# Altium schematic sheet xxxxxx.001_sh3_RTC.SchDoc
size 419 x 297 mm; DocumentNumber: 3; SheetNumber: 3; DocumentNumberE3: XXXX.467119.XXX Э3
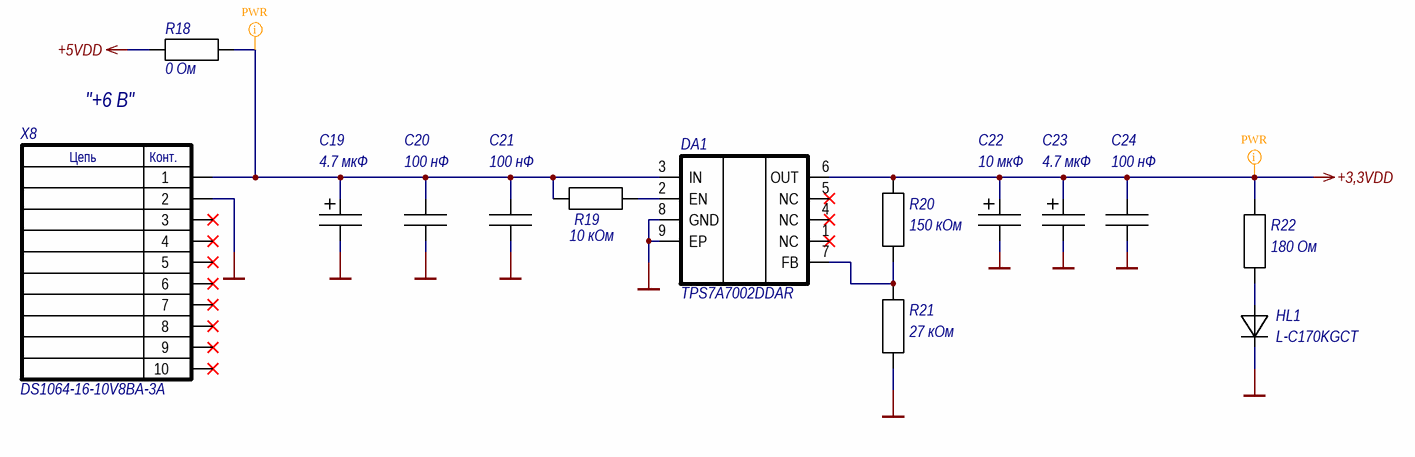
[diagram p0: xxxxxx.001_sh3_RTC.SchDoc]

## Parts
C19  4.7 мкФ  [CAPMP3216X180N]
C20  100 нФ  [CAPC160X080X080N]
C21  100 нФ  [CAPC160X080X080N]
C22  10 мкФ  [CAPMP3216X180N]
C23  4.7 мкФ  [CAPMP3216X180N]
C24  100 нФ  [CAPC160X080X080N]
DA1  TPS7A7002DDAR  [SOIC127P600X170_HS-9N]
HL1  L-C170KGCT  [LEDC200X125X075N_RED]
R18  0 Ом  [RESC160X080X045N]
R19  10 кОм  [RESC160X080X045N]
R20  150 кОм  [RESC160X080X045N]
R21  27 кОм  [RESC160X080X045N]
R22  180 Ом  [RESC160X080X045N]
X8  DS1064-16-10V8BA-3A  [BHTH127x254_2X5]

## Nets
+3,3VDD: C22.1 C23.1 C24.1 DA1.6(OUT) R20.1 R22.1
+5VDD: R18.1
GND: C19.2 C20.2 C21.2 C22.2 C23.2 C24.2 DA1.8(GND) DA1.9(EP) HL1.2 R21.2 X8.2
NetC19_1: C19.1 C20.1 C21.1 DA1.3(IN) R18.2 R19.1 X8.1
NetDA1_2: DA1.2(EN) R19.2
NetDA1_7: DA1.7(FB) R20.2 R21.1
NetHL1_1: HL1.1 R22.2

Not connected (* = marked no-connect by the designer): DA1 1(NC)* 4(NC)* 5(NC)*; X8 3* 4* 5* 6* 7* 8* 9* 10*

## Layout directives
net class PWR: +3,3VDD, NetC19_1

## Notes on the sheet
- (near R18) "+6 В"
- Подп. и дата
- Инв. № дубл.
- Взам. инв. №
- Лист
- Инв. № подл.
- Изм.
- № докум.
- Подп.
- Дата
- Копировал
- Формат A3
- (in symbol 16896) Цепь; Конт.

## Library data of the parts
C19 C23 = 16907: Solid Tantalum Surface Mount Capacitor; Manufacturer: AVX; Part Number: TAJA475M025RNJ; Number: 16907; Type: Конденсатор; Voltage: 25 В; Tolerance: ±20%; ValueBOM: Solid Tantalum Surface Mount Capacitor, CAP TNT A, 4.7u x 25V; Package: CAP TNT A; Series: TAJ; Ceramic Type: 4.7 мкФ; ValueSCH: 4.7 мкФ; HelpURL: http://www.avx.com/; ComponentLink1Description: Datasheet; ComponentLink1URL: ftp://51.15.50.217/avx/capacitors/TAJ.PDF; Modify Date: 20.02.2009; Note: *; ManufacturerPartNumber: TAJA475M025RNJ
C20 C21 C24 = 16734: Chip Monolithic Ceramic Capacitor; Manufacturer: Murata; Part Number: GRM188R71E104KA01D; Number: 16734; Type: Конденсатор; Ceramic Type: X7R; Voltage: 25 В; Tolerance: ±10%; ValueBOM: Chip Monolithic Ceramic Capacitor, 0603, X7R, 25V, ±10%, 100n; Package: 0603; Series: GRM188; ValueSCH: 100 нФ; ComponentLink1Description: Datasheet; ComponentLink1URL: ftp://51.15.50.217/murata/capacitors/chip_monolithic_ceramic_cap.pdf; Note: *; ManufacturerPartNumber: GRM188R71E104KA01D
C22 = 16905: Solid Tantalum Surface Mount Capacitor; Manufacturer: AVX; Part Number: TAJA106M016RNJ; Number: 16905; Type: Конденсатор; Voltage: 16 В; Tolerance: ±20%; ValueBOM: Solid Tantalum Surface Mount Capacitor, CAP TNT A, 10u x 16V; Package: CAP TNT A; Series: TAJ; Ceramic Type: 10 мкФ; ValueSCH: 10 мкФ; HelpURL: http://www.avx.com/; ComponentLink1Description: Datasheet; ComponentLink1URL: ftp://51.15.50.217/avx/capacitors/TAJ.PDF; Modify Date: 19.02.2009; Note: *; ManufacturerPartNumber: TAJA106M016RNJ
DA1 = 16901: Very Low Input, Very Low Dropout 3-A Regulator With Enable; Manufacturer: Texas Instruments; Number: 16901; Type: Микросхема аналоговая; Part Number: TPS7A7002DDAR; ValueSCH: TPS7A7002DDAR; ValueBOM: Very Low Input, Very Low Dropout 3-A Regulator With Enable; Modify Date: 21.06.2023; Note: *; ManufacturerPartNumber: TPS7A7002DDAR
HL1 = 16903: Светодиод поверхностного монтажа, зеленый, 0805; Manufacturer: Para Light; Number: 16903; Current: 30 мА; Intensity: 30 мКд; Color: Green; Type: Светодиод; Package: 0805; Part Number: L-C170KGCT; ValueSCH: L-C170KGCT; ValueBOM: Светодиод поверхностного монтажа, зеленый, 0805; Modify Date: 21.06.2023; Note: *; ManufacturerPartNumber: L-C170KGCT
R18 = 2058: General Purpose Chip Resistor; Manufacturer: Yageo; Part Number: RC0603JR-130R; Number: 2058; Power: 100 мВт; Tolerance: ±5%; ValueBOM: General Purpose Chip Resistor, 0603, ±5%, 0R; Type: Резистор; Package: 0603; Series: RC0603; ValueSCH: 0 Ом; HelpURL: http://www.yageo.com/e; ComponentLink1Description: Datasheet; ComponentLink1URL: ftp://51.15.50.217/yageo/resistors/RC0603_series.pdf#; Modify Date: 04.01.2009; Note: *; ManufacturerPartNumber: RC0603JR-130R
R19 = 2930: General Purpose Chip Resistor; Manufacturer: Yageo; Part Number: RC0603FR-1310K; Number: 2930; Power: 100 мВт; Tolerance: ±1%; ValueBOM: General Purpose Chip Resistor, 0603, ±1%, 10K; Type: Резистор; Package: 0603; Series: RC0603; ValueSCH: 10 кОм; HelpURL: http://www.yageo.com/e; ComponentLink1Description: Datasheet; ComponentLink1URL: ftp://51.15.50.217/yageo/resistors/RC0603_series.pdf#; Modify Date: 04.01.2009; Note: *; ManufacturerPartNumber: RC0603FR-1310K
R20 = 3062: General Purpose Chip Resistor; Manufacturer: Yageo; Part Number: RC0603FR-13150K; Number: 3062; Power: 100 мВт; Tolerance: ±1%; ValueBOM: General Purpose Chip Resistor, 0603, ±1%, 150K; Type: Резистор; Package: 0603; Series: RC0603; ValueSCH: 150 кОм; HelpURL: http://www.yageo.com/e; ComponentLink1Description: Datasheet; ComponentLink1URL: ftp://51.15.50.217/yageo/resistors/RC0603_series.pdf#; Modify Date: 04.01.2009; Note: *; ManufacturerPartNumber: RC0603FR-13150K
R21 = 2977: General Purpose Chip Resistor; Manufacturer: Yageo; Part Number: RC0603FR-1327K; Number: 2977; Power: 100 мВт; Tolerance: ±1%; ValueBOM: General Purpose Chip Resistor, 0603, ±1%, 27K; Type: Резистор; Package: 0603; Series: RC0603; ValueSCH: 27 кОм; HelpURL: http://www.yageo.com/e; ComponentLink1Description: Datasheet; ComponentLink1URL: ftp://51.15.50.217/yageo/resistors/RC0603_series.pdf#; Modify Date: 04.01.2009; Note: *; ManufacturerPartNumber: RC0603FR-1327K
R22 = 2729: General Purpose Chip Resistor; Manufacturer: Yageo; Part Number: RC0603FR-13180R; Number: 2729; Power: 100 мВт; Tolerance: ±1%; ValueBOM: General Purpose Chip Resistor, 0603, ±1%, 180R; Type: Резистор; Package: 0603; Series: RC0603; ValueSCH: 180 Ом; HelpURL: http://www.yageo.com/e; ComponentLink1Description: Datasheet; ComponentLink1URL: ftp://51.15.50.217/yageo/resistors/RC0603_series.pdf#; Modify Date: 04.01.2009; Note: *; ManufacturerPartNumber: RC0603FR-13180R
X8 = 16896: 1.27mm Box Header V/T Type H=7.1mm, 10 pin; Manufacturer: Connfly; Number: 16896; Type: Разъем; Series: DS1023-40; Part Number: DS1064-16-10V8BA-3A; ValueSCH: DS1064-16-10V8BA-3A; ValueBOM: 1.27mm Box Header V/T Type H=7.1mm, 10 pin; Modify Date: 21.06.2023; Note: *; ManufacturerPartNumber: DS1064-16-10V8BA-3A